# Altium schematic sheet FPGA.SchDoc: Carte mère embarquée - CPLD
size A3; Author: B Labbe; CompanyName: Oufffteam; DrawnBy: B Labbe; Engineer: B Labbe; Organization: Oufffteam; Address1: L3, 12a Rodborough Rd; Address2: Frenchs Forest; Address3: NSW; Address4: Australia 2086; Revision: A; SheetNumber: 4; SheetTotal: 6; DocumentName: Carte mère embarquée - CPLD
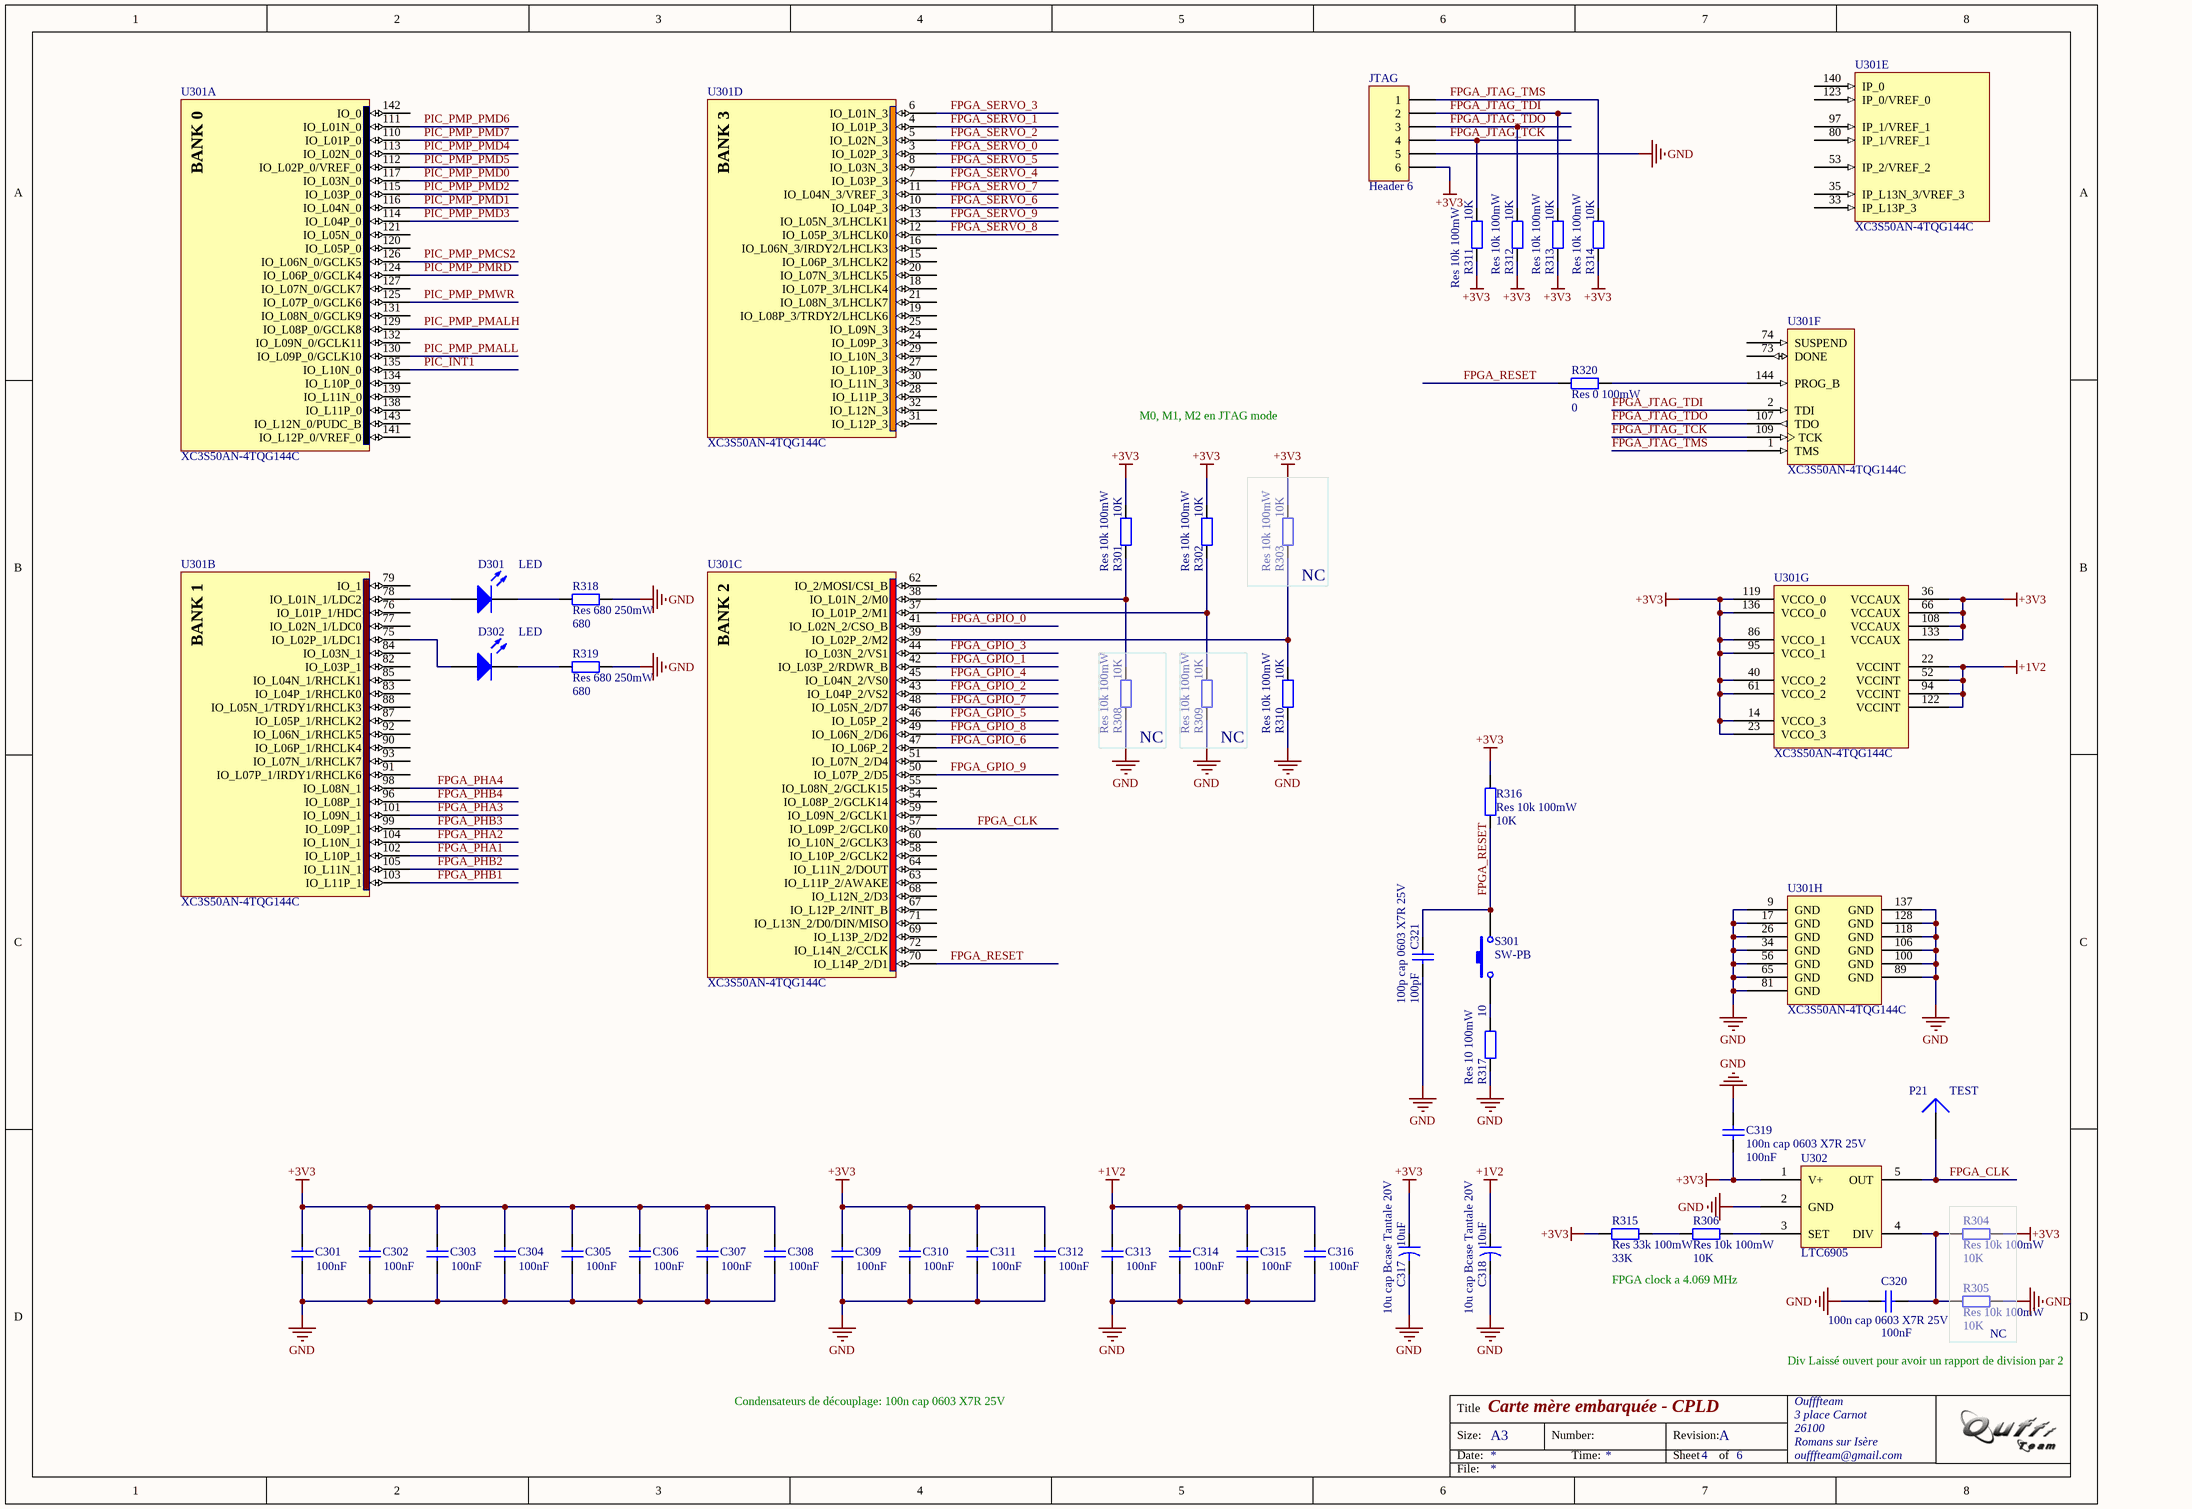
[diagram p0: FPGA.SchDoc]

## Parts
C301  value 100nF  [1608[0603]]  (hidden comment: 100n cap 0603 X7R 25V)
C302  value 100nF  [1608[0603]]  (hidden comment: 100n cap 0603 X7R 25V)
C303  value 100nF  [1608[0603]]  (hidden comment: 100n cap 0603 X7R 25V)
C304  value 100nF  [1608[0603]]  (hidden comment: 100n cap 0603 X7R 25V)
C305  value 100nF  [1608[0603]]  (hidden comment: 100n cap 0603 X7R 25V)
C306  value 100nF  [1608[0603]]  (hidden comment: 100n cap 0603 X7R 25V)
C307  value 100nF  [1608[0603]]  (hidden comment: 100n cap 0603 X7R 25V)
C308  value 100nF  [1608[0603]]  (hidden comment: 100n cap 0603 X7R 25V)
C309  value 100nF  [1608[0603]]  (hidden comment: 100n cap 0603 X7R 25V)
C310  value 100nF  [1608[0603]]  (hidden comment: 100n cap 0603 X7R 25V)
C311  value 100nF  [1608[0603]]  (hidden comment: 100n cap 0603 X7R 25V)
C312  value 100nF  [1608[0603]]  (hidden comment: 100n cap 0603 X7R 25V)
C313  value 100nF  [1608[0603]]  (hidden comment: 100n cap 0603 X7R 25V)
C314  value 100nF  [1608[0603]]  (hidden comment: 100n cap 0603 X7R 25V)
C315  value 100nF  [1608[0603]]  (hidden comment: 100n cap 0603 X7R 25V)
C316  value 100nF  [1608[0603]]  (hidden comment: 100n cap 0603 X7R 25V)
C317  10u cap Bcase Tantale 20V  value 10uF  [6032]
C318  10u cap Bcase Tantale 20V  value 10uF  [6032]
C319  100n cap 0603 X7R 25V  value 100nF  [1608[0603]]
C320  100n cap 0603 X7R 25V  value 100nF  [1608[0603]]
C321  100p cap 0603 X7R 25V  value 100pF  [1608[0603]]
D301  LED  [1608[0603]]
D302  LED  [1608[0603]]
JTAG  Header 6  [HDR1X6]
P21  TEST  [TP1]
R301  Res 10k 100mW  value 10K  [1608[0603]]
R302  Res 10k 100mW  value 10K  [1608[0603]]
R303  Res 10k 100mW  value 10K  [1608[0603]]
R304  Res 10k 100mW  value 10K  [1608[0603]]
R305  Res 10k 100mW  value 10K  [1608[0603]]
R306  Res 10k 100mW  value 10K  [1608[0603]]
R308  Res 10k 100mW  value 10K  [1608[0603]]
R309  Res 10k 100mW  value 10K  [1608[0603]]
R310  Res 10k 100mW  value 10K  [1608[0603]]
R311  Res 10k 100mW  value 10K  [1608[0603]]
R312  Res 10k 100mW  value 10K  [1608[0603]]
R313  Res 10k 100mW  value 10K  [1608[0603]]
R314  Res 10k 100mW  value 10K  [1608[0603]]
R315  Res 33k 100mW  value 33K  [1608[0603]]
R316  Res 10k 100mW  value 10K  [1608[0603]]
R317  Res 10 100mW  value 10  [1608[0603]]
R318  Res 680 250mW  value 680  [1608[0603]]
R319  Res 680 250mW  value 680  [1608[0603]]
R320  Res 0 100mW  value 0  [1608[0603]]
S301  SW-PB  [BP1]
U301  XC3S50AN-4TQG144C  [TQG144_N]  (parts A,B,C,D,E,F,G,H of 8)
U302  LTC6905  [S5]

## Blocks framed on the sheet
NC: R303
NC: R308
NC: R309
NC: R304 R305

## Nets
+1V2: C313.2 C314.2 C315.2 C316.2 C318.1 U301.22(VCCINT) U301.52(VCCINT) U301.94(VCCINT) U301.122(VCCINT)
+3V3: C301.2 C302.2 C303.2 C304.2 C305.2 C306.2 C307.2 C308.2 C309.2 C310.2 C311.2 C312.2 C317.1 C319.1 JTAG.6 R301.2 R302.2 R303.2 R304.2 R311.1 R312.1 R313.1 R314.1 R315.1 R316.2 U301.14(VCCO_3) U301.23(VCCO_3) U301.36(VCCAUX) U301.40(VCCO_2) U301.61(VCCO_2) U301.66(VCCAUX) U301.86(VCCO_1) U301.95(VCCO_1) U301.108(VCCAUX) U301.119(VCCO_0) U301.133(VCCAUX) U301.136(VCCO_0) U302.1(V+)
GND: C301.1 C302.1 C303.1 C304.1 C305.1 C306.1 C307.1 C308.1 C309.1 C310.1 C311.1 C312.1 C313.1 C314.1 C315.1 C316.1 C317.2 C318.2 C319.2 C320.1 C321.1 JTAG.5 R305.2 R308.1 R309.1 R310.1 R317.1 R318.2 R319.2 U301.9(GND) U301.17(GND) U301.26(GND) U301.34(GND) U301.56(GND) U301.65(GND) U301.81(GND) U301.89(GND) U301.100(GND) U301.106(GND) U301.118(GND) U301.128(GND) U301.137(GND) U302.2(GND)
FPGA_CLK: P21.1 U301.57(IO_L09P_2/GCLK0) U302.5(OUT)
FPGA_GPIO_0: U301.41(IO_L02N_2/CSO_B)
FPGA_GPIO_1: U301.42(IO_L03P_2/RDWR_B)
FPGA_GPIO_2: U301.43(IO_L04P_2/VS2)
FPGA_GPIO_3: U301.44(IO_L03N_2/VS1)
FPGA_GPIO_4: U301.45(IO_L04N_2/VS0)
FPGA_GPIO_5: U301.46(IO_L05P_2)
FPGA_GPIO_6: U301.47(IO_L06P_2)
FPGA_GPIO_7: U301.48(IO_L05N_2/D7)
FPGA_GPIO_8: U301.49(IO_L06N_2/D6)
FPGA_GPIO_9: U301.50(IO_L07P_2/D5)
FPGA_JTAG_TCK: JTAG.4 R311.2 U301.109(TCK)
FPGA_JTAG_TDI: JTAG.2 R313.2 U301.2(TDI)
FPGA_JTAG_TDO: JTAG.3 R312.2 U301.107(TDO)
FPGA_JTAG_TMS: JTAG.1 R314.2 U301.1(TMS)
FPGA_PHA1: U301.102(IO_L10P_1)
FPGA_PHA2: U301.104(IO_L10N_1)
FPGA_PHA3: U301.101(IO_L09N_1)
FPGA_PHA4: U301.98(IO_L08N_1)
FPGA_PHB1: U301.103(IO_L11P_1)
FPGA_PHB2: U301.105(IO_L11N_1)
FPGA_PHB3: U301.99(IO_L09P_1)
FPGA_PHB4: U301.96(IO_L08P_1)
FPGA_RESET: C321.2 R316.1 R320.1 S301.3 U301.70(IO_L14P_2/D1)
FPGA_SERVO_0: U301.3(IO_L02P_3)
FPGA_SERVO_1: U301.4(IO_L01P_3)
FPGA_SERVO_2: U301.5(IO_L02N_3)
FPGA_SERVO_3: U301.6(IO_L01N_3)
FPGA_SERVO_4: U301.7(IO_L03P_3)
FPGA_SERVO_5: U301.8(IO_L03N_3)
FPGA_SERVO_6: U301.10(IO_L04P_3)
FPGA_SERVO_7: U301.11(IO_L04N_3/VREF_3)
FPGA_SERVO_8: U301.12(IO_L05P_3/LHCLK0)
FPGA_SERVO_9: U301.13(IO_L05N_3/LHCLK1)
PIC_INT1: U301.135(IO_L10N_0)
PIC_PMP_PMALH: U301.129(IO_L08P_0/GCLK8)
PIC_PMP_PMALL: U301.130(IO_L09P_0/GCLK10)
PIC_PMP_PMCS2: U301.126(IO_L06N_0/GCLK5)
PIC_PMP_PMD0: U301.117(IO_L03N_0)
PIC_PMP_PMD1: U301.116(IO_L04N_0)
PIC_PMP_PMD2: U301.115(IO_L03P_0)
PIC_PMP_PMD3: U301.114(IO_L04P_0)
PIC_PMP_PMD4: U301.113(IO_L02N_0)
PIC_PMP_PMD5: U301.112(IO_L02P_0/VREF_0)
PIC_PMP_PMD6: U301.111(IO_L01N_0)
PIC_PMP_PMD7: U301.110(IO_L01P_0)
PIC_PMP_PMRD: U301.124(IO_L06P_0/GCLK4)
PIC_PMP_PMWR: U301.125(IO_L07P_0/GCLK6)
NetC320_2: C320.2 R304.1 R305.1 U302.4(DIV)
NetD301_1: D301.1(A) U301.78(IO_L01N_1/LDC2)
NetD301_2: D301.2(K) R318.1
NetD302_1: D302.1(A) U301.75(IO_L02P_1/LDC1)
NetD302_2: D302.2(K) R319.1
NetR301_1: R301.1 R308.2 U301.38(IO_L01N_2/M0)
NetR302_1: R302.1 R309.2 U301.37(IO_L01P_2/M1)
NetR303_1: R303.1 R310.2 U301.39(IO_L02P_2/M2)
NetR306_1: R306.1 R315.2
NetR306_2: R306.2 U302.3(SET)
NetR317_2: R317.2 S301.1
NetR320_2: R320.2 U301.144(PROG_B)

Not connected (* = marked no-connect by the designer): U301 15(IO_L06P_3/LHCLK2) 16(IO_L06N_3/IRDY2/LHCLK3) 18(IO_L07P_3/LHCLK4) 19(IO_L08P_3/TRDY2/LHCLK6) 20(IO_L07N_3/LHCLK5) 21(IO_L08N_3/LHCLK7) 24(IO_L09P_3) 25(IO_L09N_3) 27(IO_L10P_3) 28(IO_L11P_3) 29(IO_L10N_3) 30(IO_L11N_3) 31(IO_L12P_3) 32(IO_L12N_3) 33(IP_L13P_3) 35(IP_L13N_3/VREF_3) 51(IO_L07N_2/D4) 53(IP_2/VREF_2) 54(IO_L08P_2/GCLK14) 55(IO_L08N_2/GCLK15) 58(IO_L10P_2/GCLK2) 59(IO_L09N_2/GCLK1) 60(IO_L10N_2/GCLK3) 62(IO_2/MOSI/CSI_B) 63(IO_L11P_2/AWAKE) 64(IO_L11N_2/DOUT) 67(IO_L12P_2/INIT_B) 68(IO_L12N_2/D3) 69(IO_L13P_2/D2) 71(IO_L13N_2/D0/DIN/MISO) 72(IO_L14N_2/CCLK) 73(DONE) 74(SUSPEND) 76(IO_L01P_1/HDC) 77(IO_L02N_1/LDC0) 79(IO_1) 80(IP_1/VREF_1) 82(IO_L03P_1) 83(IO_L04P_1/RHCLK0) 84(IO_L03N_1) 85(IO_L04N_1/RHCLK1) 87(IO_L05P_1/RHCLK2) 88(IO_L05N_1/TRDY1/RHCLK3) 90(IO_L06P_1/RHCLK4) 91(IO_L07P_1/IRDY1/RHCLK6) 92(IO_L06N_1/RHCLK5) 93(IO_L07N_1/RHCLK7) 97(IP_1/VREF_1) 120(IO_L05P_0) 121(IO_L05N_0) 123(IP_0/VREF_0) 127(IO_L07N_0/GCLK7) 131(IO_L08N_0/GCLK9) 132(IO_L09N_0/GCLK11) 134(IO_L10P_0) 138(IO_L11P_0) 139(IO_L11N_0) 140(IP_0) 141(IO_L12P_0/VREF_0) 142(IO_0) 143(IO_L12N_0/PUDC_B)

## Notes on the sheet
- M0, M1, M2 en JTAG mode
- FPGA clock a 4.069 MHz
- Div Laissé ouvert pour avoir un rapport de division par 2
- Condensateurs de découplage: 100n cap 0603 X7R 25V
- Title
- Size:
- Date:
- A3
- Number:
- Time:
- Revision:
- Sheet
- of
- Oufffteam
- 3 place Carnot
- 26100
- Romans sur Isère
- oufffteam@gmail.com
- File:
- (in symbol XC3S50AN-4TQG144C, part A) BANK 0
- (in symbol XC3S50AN-4TQG144C, part B) BANK 1
- (in symbol XC3S50AN-4TQG144C, part C) BANK 2
- (in symbol XC3S50AN-4TQG144C, part D) BANK 3

## Library data of the parts
C301-C316 C319-C321 = Cap: Capacitor; Published: 8-Jun-2000; LatestRevisionDate: 17-Jul-2002; LatestRevisionNote: Re-released for DXP Platform.; PackageReference: RAD-0.3; Publisher: Altium Limited
C317 C318 = Cap2: Capacitor; Published: 23-Sep-2002; PackageReference: CAPR5-4X5; Publisher: Altium Limited
D301 D302 = LED0: LED SML-311DTT86; Published: 8-Jun-2000; LatestRevisionDate: 08-Jul-2005; LatestRevisionNote: Mech Layer 1 removed.; PackageReference: LED-0; Publisher: Altium Limited
JTAG = Header 6: Header, 6-Pin; LatestRevisionDate: 17-Jul-2002; LatestRevisionNote: Re-released for DXP Platform.; Publisher: Altium Limited
P21 = Plug: LatestRevisionDate: 17-Jul-2002; LatestRevisionNote: Re-released for DXP Platform.; Publisher: Altium Limited
R301-R306 R308-R320 = Res2: Resistor; Published: 8-Jun-2000; LatestRevisionDate: 17-Jul-2002; LatestRevisionNote: Re-released for DXP Platform.; PackageReference: AXIAL-0.4; Publisher: Altium Limited
S301 = SW-PB: Switch; Published: 24-Mar-1999; LatestRevisionDate: 17-Jul-2002; LatestRevisionNote: Re-released for DXP Platform.; PackageReference: SPST-2; Publisher: Altium Limited
U301 = XC3S50AN-4TQG144C: Spartan-3AN Non-Volatile FPGA, 108 User I/Os, 144-Pin TQFP, Standard Performance, Commercial Grade, Pb-Free; Published: 20-Jul-2007; DatasheetVersion: 26-Feb-2007; PackageVersion: ver1.2, Jun-2004; PackageReference: TQG144; Publisher: Altium Limited; PackageDescription: 144-Pin Thin Quad Flat Pack (TQG144) - Pb-Free; Code_JEDEC: MS-026-BFB; ComponentLink1Description: Manufacturer Link; ComponentLink1URL: http://www.xilinx.com/products/silicon_solutions/fpgas/spartan_series/spartan3an_fpgas/index.htm; ComponentLink2Description: Datasheet; ComponentLink2URL: http://direct.xilinx.com/bvdocs/publications/ds557.pdf
U302 = LTC6905: 17MHz to 170MHz Resistor Set SOT-23 Oscillator